# Altium schematic sheet Esquema_gen_ETRX.SchDoc
size A4; SheetNumber: 1; SheetTotal: 1
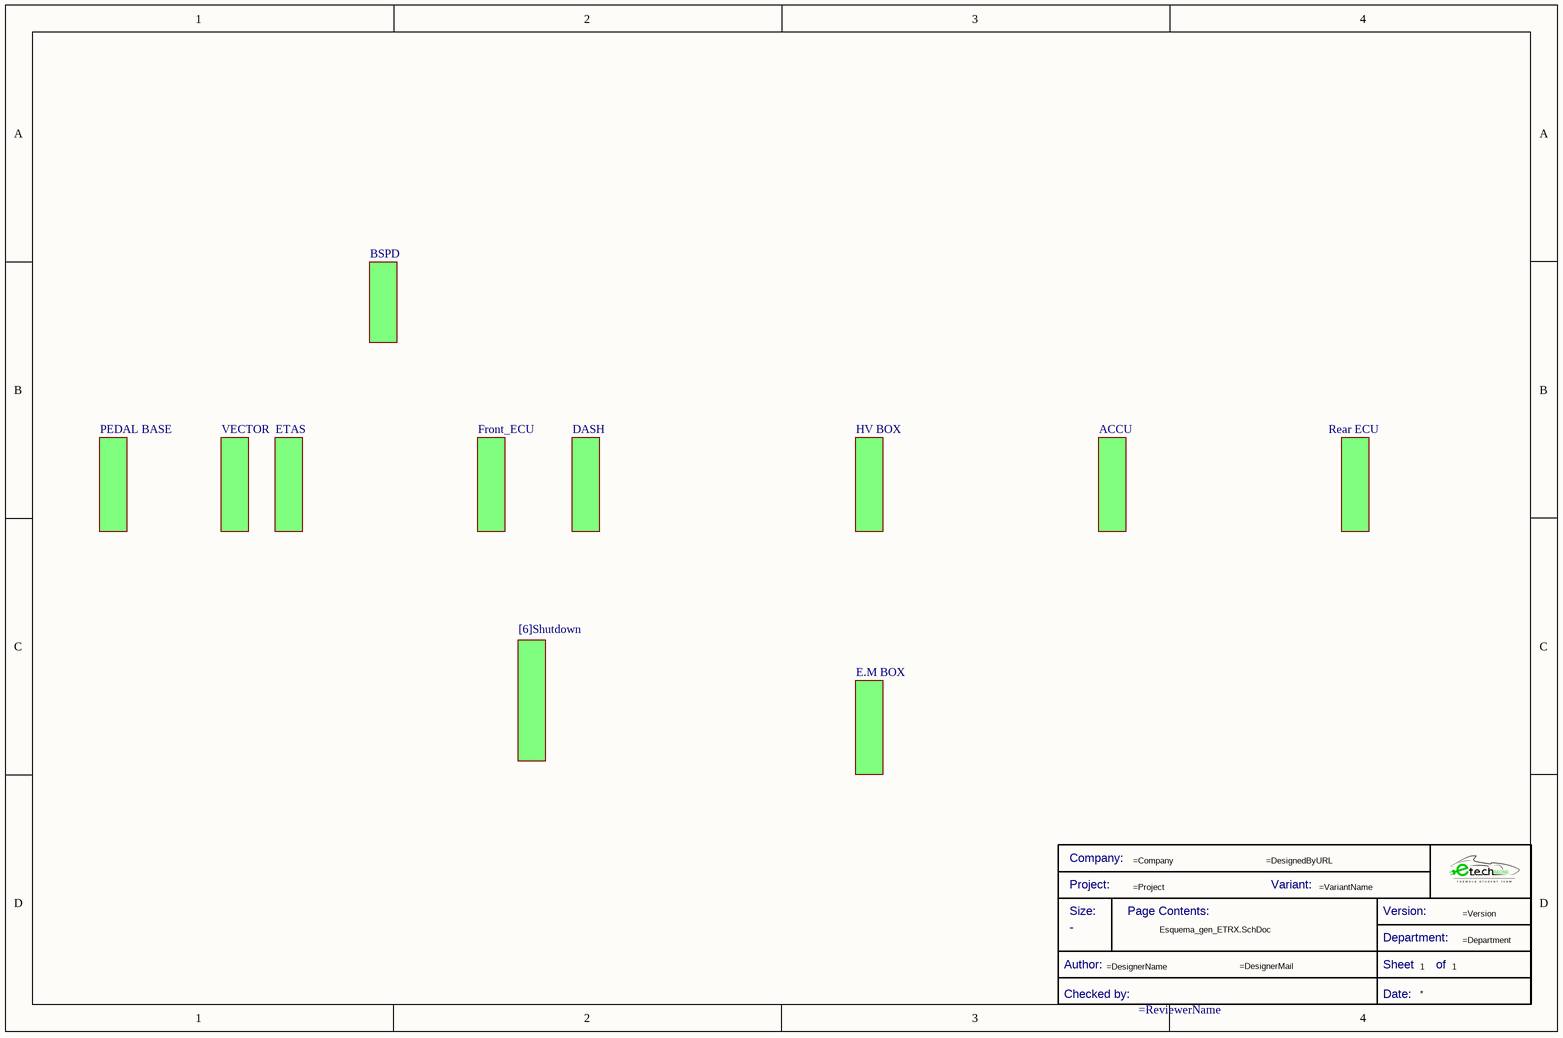
[diagram p0: Esquema_gen_ETRX.SchDoc]

## Parts
*  Title Block_template  (value not drawn)  (graphical)

## Sub-sheets
[6]Shutdown = [6]Shutdown: no entries
Designator = Rear ECU: no entries
Designator = HV BOX: no entries
Designator = DASH: no entries
Designator = E.M BOX: no entries
Designator = ACCU: no entries
Designator = ETAS: no entries
Designator = VECTOR: no entries
Designator = BSPD: no entries
Designator = PEDAL BASE: no entries
Jose maricon = Front_ECU: no entries

## Notes on the sheet
- (in symbol Title Block_template) Company:; Project:; Variant:; Size:; Page Contents:; Version:; Department:; Author:; Sheet; of; Checked by:; Date:

## Library data of the parts
* = Title Block_template: Standard Title Block; .Creator: GP; Category: Title Block; .PCBcheck: GP; .SCHcheck: GP; Checked by:: =ReviewerName; Size: -